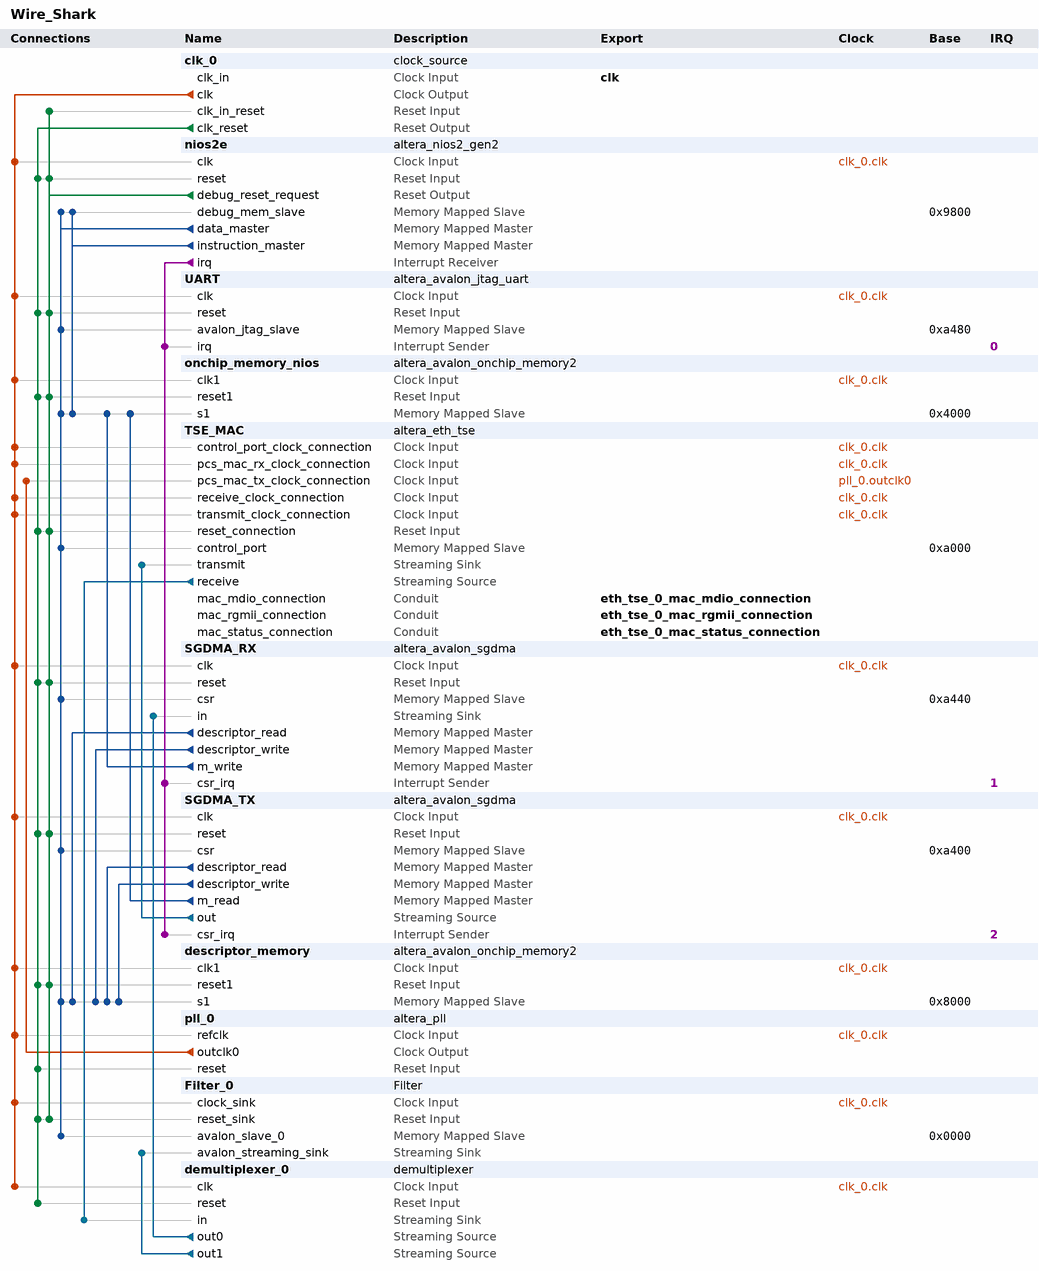
[diagram p0: system contents]
# Platform Designer (Qsys) system Wire_Shark, Cyclone V 5CSXFC6D6F31C6
# Parameters at their usual value, and those the tool derives, are not listed.
package require -exact qsys 18.1
create_system Wire_Shark
set_project_property DEVICE_FAMILY {Cyclone V}
set_project_property DEVICE 5CSXFC6D6F31C6

add_instance clk_0 clock_source 18.1
set_instance_parameter_value clk_0 clockFrequency 50000000

add_instance nios2e altera_nios2_gen2 18.1
set_instance_parameter_value nios2e dcache_size 2048
set_instance_parameter_value nios2e exceptionSlave onchip_memory_nios.s1
set_instance_parameter_value nios2e icache_size 4096
set_instance_parameter_value nios2e impl Tiny
set_instance_parameter_value nios2e resetSlave onchip_memory_nios.s1

add_instance UART altera_avalon_jtag_uart 18.1
set_instance_parameter_value UART simInteractiveOptions NO_INTERACTIVE_WINDOWS

add_instance onchip_memory_nios altera_avalon_onchip_memory2 18.1
set_instance_parameter_value onchip_memory_nios dataWidth 32
set_instance_parameter_value onchip_memory_nios dualPort false
set_instance_parameter_value onchip_memory_nios initMemContent false
set_instance_parameter_value onchip_memory_nios initializationFileName onchip_mem.hex
set_instance_parameter_value onchip_memory_nios memorySize 16384

add_instance TSE_MAC altera_eth_tse 18.1
set_instance_parameter_value TSE_MAC XCVR_RCFG_JTAG_ENABLE 0
set_instance_parameter_value TSE_MAC XCVR_SET_CAPABILITY_REG_ENABLE 0
set_instance_parameter_value TSE_MAC XCVR_SET_CSR_SOFT_LOGIC_ENABLE 0
set_instance_parameter_value TSE_MAC XCVR_SET_PRBS_SOFT_LOGIC_ENABLE 0
set_instance_parameter_value TSE_MAC XCVR_SET_USER_IDENTIFIER 0
set_instance_parameter_value TSE_MAC core_variation MAC_ONLY
set_instance_parameter_value TSE_MAC enable_hd_logic true
set_instance_parameter_value TSE_MAC enable_mac_flow_ctrl false
set_instance_parameter_value TSE_MAC enable_magic_detect true
set_instance_parameter_value TSE_MAC enable_shift16 true
set_instance_parameter_value TSE_MAC ifGMII RGMII
set_instance_parameter_value TSE_MAC ing_addr 11
set_instance_parameter_value TSE_MAC mdio_clk_div 40
set_instance_parameter_value TSE_MAC stat_cnt_ena true
set_instance_parameter_value TSE_MAC transceiver_type NONE

add_instance SGDMA_RX altera_avalon_sgdma 18.1
set_instance_parameter_value SGDMA_RX enableBurstTransfers false
set_instance_parameter_value SGDMA_RX enableUnalignedTransfers false
set_instance_parameter_value SGDMA_RX readBlockDataWidth 32
set_instance_parameter_value SGDMA_RX sinkErrorWidth 6
set_instance_parameter_value SGDMA_RX sourceErrorWidth 0
set_instance_parameter_value SGDMA_RX transferMode STREAM_TO_MEMORY
set_instance_parameter_value SGDMA_RX writeBurstcountWidth 4

add_instance SGDMA_TX altera_avalon_sgdma 18.1
set_instance_parameter_value SGDMA_TX enableBurstTransfers false
set_instance_parameter_value SGDMA_TX enableUnalignedTransfers false
set_instance_parameter_value SGDMA_TX readBlockDataWidth 32
set_instance_parameter_value SGDMA_TX sinkErrorWidth 0
set_instance_parameter_value SGDMA_TX sourceErrorWidth 1
set_instance_parameter_value SGDMA_TX transferMode MEMORY_TO_STREAM
set_instance_parameter_value SGDMA_TX writeBurstcountWidth 4

add_instance descriptor_memory altera_avalon_onchip_memory2 18.1
set_instance_parameter_value descriptor_memory dataWidth 32
set_instance_parameter_value descriptor_memory dualPort false
set_instance_parameter_value descriptor_memory initMemContent true
set_instance_parameter_value descriptor_memory initializationFileName onchip_mem.hex
set_instance_parameter_value descriptor_memory memorySize 4096

add_instance pll_0 altera_pll 18.1
set_instance_parameter_value pll_0 gui_device_speed_grade 1
set_instance_parameter_value pll_0 gui_number_of_clocks 1
set_instance_parameter_value pll_0 gui_operation_mode direct
set_instance_parameter_value pll_0 gui_output_clock_frequency0 125.0
set_instance_parameter_value pll_0 gui_pll_mode {Integer-N PLL}
set_instance_parameter_value pll_0 gui_reference_clock_frequency 100.0
set_instance_parameter_value pll_0 gui_use_locked true

add_instance Filter_0 Filter 1.0

add_instance demultiplexer_0 demultiplexer 18.1
set_instance_parameter_value demultiplexer_0 bitsPerSymbol 8
set_instance_parameter_value demultiplexer_0 errorWidth 0
set_instance_parameter_value demultiplexer_0 inChannelWidth 1
set_instance_parameter_value demultiplexer_0 numOutputInterfaces 2
set_instance_parameter_value demultiplexer_0 symbolsPerBeat 4
set_instance_parameter_value demultiplexer_0 useHighBitsOfChannel true
set_instance_parameter_value demultiplexer_0 usePackets true

# connections
add_connection clk_0.clk demultiplexer_0.clk clock
add_connection clk_0.clk descriptor_memory.clk1 clock
add_connection clk_0.clk Filter_0.clock_sink clock
add_connection clk_0.clk nios2e.clk clock
add_connection clk_0.clk onchip_memory_nios.clk1 clock
add_connection clk_0.clk pll_0.refclk clock
add_connection clk_0.clk SGDMA_RX.clk clock
add_connection clk_0.clk SGDMA_TX.clk clock
add_connection clk_0.clk TSE_MAC.control_port_clock_connection clock
add_connection clk_0.clk TSE_MAC.pcs_mac_rx_clock_connection clock
add_connection clk_0.clk TSE_MAC.receive_clock_connection clock
add_connection clk_0.clk TSE_MAC.transmit_clock_connection clock
add_connection clk_0.clk UART.clk clock
add_connection pll_0.outclk0 TSE_MAC.pcs_mac_tx_clock_connection clock
add_connection clk_0.clk_reset demultiplexer_0.reset reset
add_connection clk_0.clk_reset descriptor_memory.reset1 reset
add_connection clk_0.clk_reset Filter_0.reset_sink reset
add_connection clk_0.clk_reset nios2e.reset reset
add_connection clk_0.clk_reset onchip_memory_nios.reset1 reset
add_connection clk_0.clk_reset pll_0.reset reset
add_connection clk_0.clk_reset SGDMA_RX.reset reset
add_connection clk_0.clk_reset SGDMA_TX.reset reset
add_connection clk_0.clk_reset TSE_MAC.reset_connection reset
add_connection clk_0.clk_reset UART.reset reset
add_connection nios2e.debug_reset_request clk_0.clk_in_reset reset
add_connection nios2e.debug_reset_request descriptor_memory.reset1 reset
add_connection nios2e.debug_reset_request Filter_0.reset_sink reset
add_connection nios2e.debug_reset_request nios2e.reset reset
add_connection nios2e.debug_reset_request onchip_memory_nios.reset1 reset
add_connection nios2e.debug_reset_request SGDMA_RX.reset reset
add_connection nios2e.debug_reset_request SGDMA_TX.reset reset
add_connection nios2e.debug_reset_request TSE_MAC.reset_connection reset
add_connection nios2e.debug_reset_request UART.reset reset
add_connection nios2e.data_master descriptor_memory.s1 avalon
set_connection_parameter_value nios2e.data_master/descriptor_memory.s1 baseAddress 0x8000
add_connection nios2e.data_master Filter_0.avalon_slave_0 avalon
set_connection_parameter_value nios2e.data_master/Filter_0.avalon_slave_0 baseAddress 0x0000
add_connection nios2e.data_master nios2e.debug_mem_slave avalon
set_connection_parameter_value nios2e.data_master/nios2e.debug_mem_slave baseAddress 0x9800
add_connection nios2e.data_master onchip_memory_nios.s1 avalon
set_connection_parameter_value nios2e.data_master/onchip_memory_nios.s1 baseAddress 0x4000
add_connection nios2e.data_master SGDMA_RX.csr avalon
set_connection_parameter_value nios2e.data_master/SGDMA_RX.csr baseAddress 0xa440
add_connection nios2e.data_master SGDMA_TX.csr avalon
set_connection_parameter_value nios2e.data_master/SGDMA_TX.csr baseAddress 0xa400
add_connection nios2e.data_master TSE_MAC.control_port avalon
set_connection_parameter_value nios2e.data_master/TSE_MAC.control_port baseAddress 0xa000
add_connection nios2e.data_master UART.avalon_jtag_slave avalon
set_connection_parameter_value nios2e.data_master/UART.avalon_jtag_slave baseAddress 0xa480
add_connection nios2e.instruction_master nios2e.debug_mem_slave avalon
set_connection_parameter_value nios2e.instruction_master/nios2e.debug_mem_slave baseAddress 0x9800
add_connection nios2e.instruction_master onchip_memory_nios.s1 avalon
set_connection_parameter_value nios2e.instruction_master/onchip_memory_nios.s1 baseAddress 0x4000
add_connection SGDMA_RX.descriptor_read descriptor_memory.s1 avalon
set_connection_parameter_value SGDMA_RX.descriptor_read/descriptor_memory.s1 baseAddress 0x8000
add_connection SGDMA_RX.descriptor_write descriptor_memory.s1 avalon
set_connection_parameter_value SGDMA_RX.descriptor_write/descriptor_memory.s1 baseAddress 0x8000
add_connection SGDMA_RX.m_write onchip_memory_nios.s1 avalon
set_connection_parameter_value SGDMA_RX.m_write/onchip_memory_nios.s1 baseAddress 0x4000
add_connection SGDMA_TX.descriptor_read descriptor_memory.s1 avalon
set_connection_parameter_value SGDMA_TX.descriptor_read/descriptor_memory.s1 baseAddress 0x8000
add_connection SGDMA_TX.descriptor_write descriptor_memory.s1 avalon
set_connection_parameter_value SGDMA_TX.descriptor_write/descriptor_memory.s1 baseAddress 0x8000
add_connection SGDMA_TX.m_read onchip_memory_nios.s1 avalon
set_connection_parameter_value SGDMA_TX.m_read/onchip_memory_nios.s1 baseAddress 0x4000
add_connection demultiplexer_0.out0 SGDMA_RX.in avalon_streaming
add_connection demultiplexer_0.out1 Filter_0.avalon_streaming_sink avalon_streaming
add_connection SGDMA_TX.out TSE_MAC.transmit avalon_streaming
add_connection TSE_MAC.receive demultiplexer_0.in avalon_streaming
add_connection nios2e.irq SGDMA_RX.csr_irq interrupt
set_connection_parameter_value nios2e.irq/SGDMA_RX.csr_irq irqNumber 1
add_connection nios2e.irq SGDMA_TX.csr_irq interrupt
set_connection_parameter_value nios2e.irq/SGDMA_TX.csr_irq irqNumber 2
add_connection nios2e.irq UART.irq interrupt
set_connection_parameter_value nios2e.irq/UART.irq irqNumber 0

# exported interfaces
add_interface clk clock sink
set_interface_property clk EXPORT_OF clk_0.clk_in
add_interface eth_tse_0_mac_mdio_connection conduit end
set_interface_property eth_tse_0_mac_mdio_connection EXPORT_OF TSE_MAC.mac_mdio_connection
add_interface eth_tse_0_mac_rgmii_connection conduit end
set_interface_property eth_tse_0_mac_rgmii_connection EXPORT_OF TSE_MAC.mac_rgmii_connection
add_interface eth_tse_0_mac_status_connection conduit end
set_interface_property eth_tse_0_mac_status_connection EXPORT_OF TSE_MAC.mac_status_connection

set_interconnect_requirement {$system} qsys_mm.clockCrossingAdapter HANDSHAKE
set_interconnect_requirement {$system} qsys_mm.enableEccProtection FALSE
set_interconnect_requirement {$system} qsys_mm.insertDefaultSlave FALSE
set_interconnect_requirement {$system} qsys_mm.maxAdditionalLatency 1

save_system Wire_Shark.qsys
